# Altium project USB to SATA bridge.PrjPcb (part 2 of 2)

## Sheet Power.SchDoc
size A3; SheetNumber: 3; SheetTotal: 3
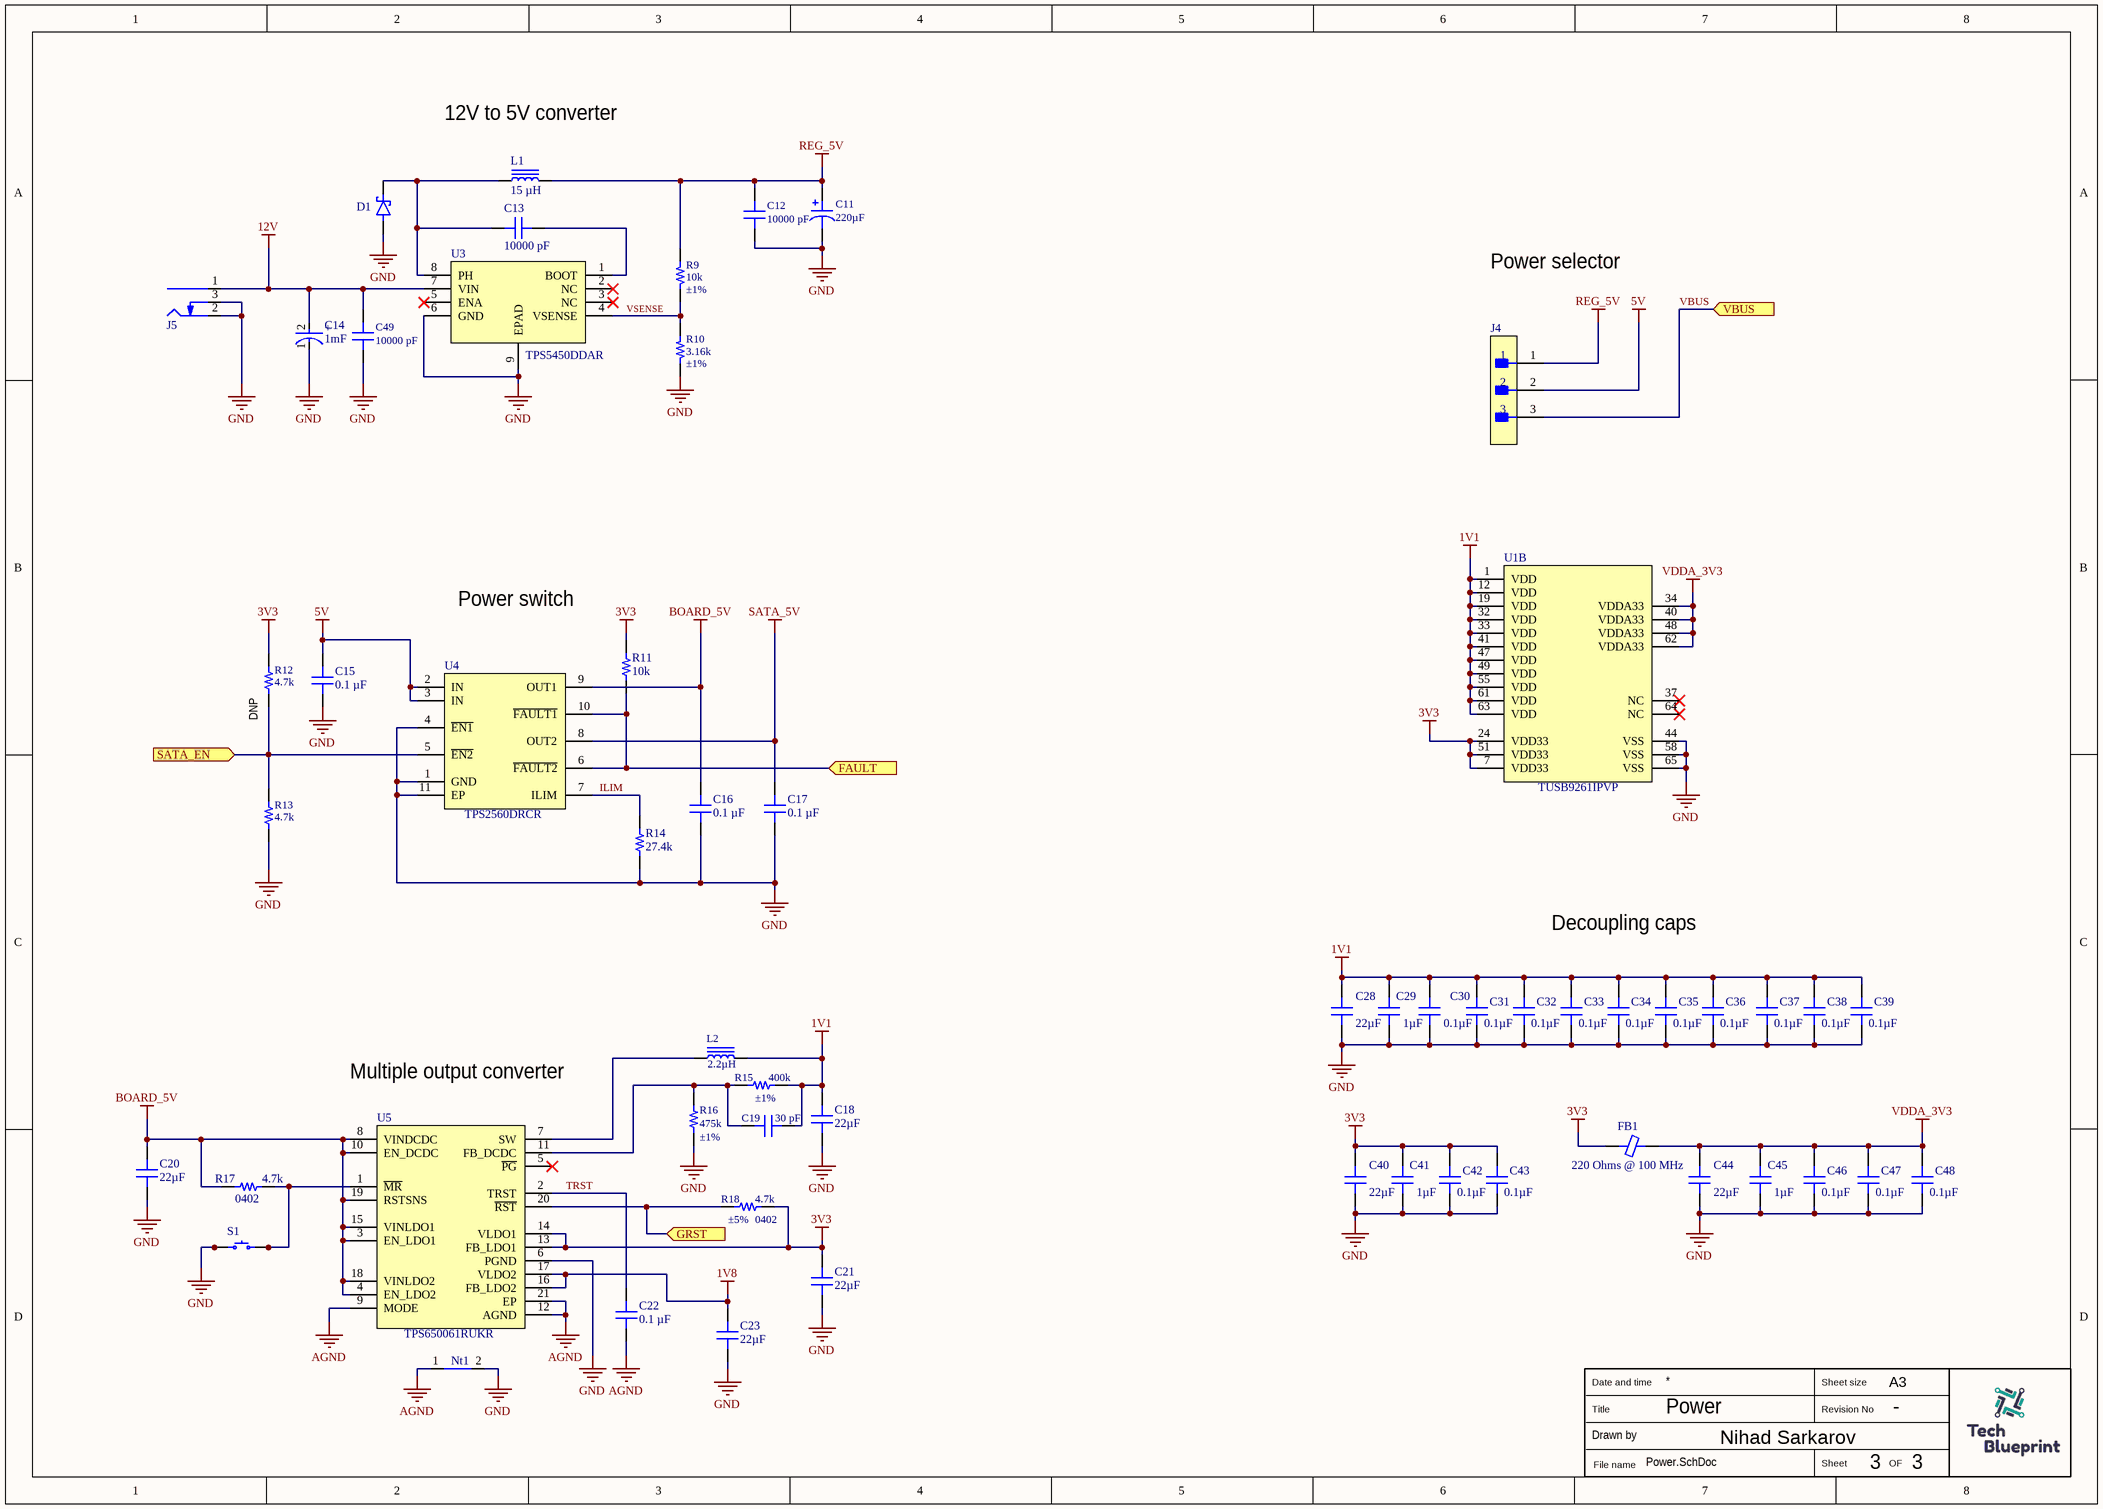
[diagram p2: Power.SchDoc]

### Parts
C11  220µF  [CAP ALSMD 8.3MM H10.5MM]
C12  10000 pF  [CAP 0805_2012]
C13  10000 pF  [CAP 0805_2012]
C14  Capacitance: 1mF  [FP-FTG-MFG]  (hidden comment: EEEFT1C102AP)
C15  0.1 µF  [CAP 0603_1608]
C16  0.1 µF  [CAP 0603_1608]
C17  0.1 µF  [CAP 0603_1608]
C18  22µF  [CAP 1206_3216 - 1.8MM]
C19  30 pF  [CAP 0402_1005]
C20  22µF  [CAP 1206_3216 - 1.8MM]
C21  22µF  [CAP 1206_3216 - 1.8MM]
C22  0.1 µF  [CAP 0603_1608]
C23  22µF  [CAP 1206_3216 - 1.8MM]
C28  22µF  [CAP 1206_3216 - 1.8MM]
C29  1µF  [CAP 0805_2012]
C30  0.1µF  [CAP 0805_2012]
C31  0.1µF  [CAP 0603_1608]
C32  0.1µF  [CAP 0603_1608]
C33  0.1µF  [CAP 0603_1608]
C34  0.1µF  [CAP 0603_1608]
C35  0.1µF  [CAP 0603_1608]
C36  0.1µF  [CAP 0603_1608]
C37  0.1µF  [CAP 0603_1608]
C38  0.1µF  [CAP 0603_1608]
C39  0.1µF  [CAP 0603_1608]
C40  22µF  [CAP 1206_3216 - 1.8MM]
C41  1µF  [CAP 0805_2012]
C42  0.1µF  [CAP 0603_1608]
C43  0.1µF  [CAP 0603_1608]
C44  22µF  [CAP 1206_3216 - 1.8MM]
C45  1µF  [CAP 0805_2012]
C46  0.1µF  [CAP 0603_1608]
C47  0.1µF  [CAP 0603_1608]
C48  0.1µF  [CAP 0603_1608]
C49  10000 pF  [CAP 0805_2012]
D1  MBRS540T3G  [DIOM7959X261N]  (value not drawn)
FB1  220 Ohms @ 100 MHz  [FER 0603_1608]
J4  87224-3  [FP-87224-3-MFG]  (value not drawn)
J5  PJ-002AH-SMT-TR  [CUI PJ-002AH-SMT-TR]  (value not drawn)
L1  15 µH  [BOURNS SRR1280]
L2  2.2µH  [IND 1008_2520]
Nt1  Net tie  [Net tie]  (value not drawn)  (net tie, no BOM)
R9  Tolerance: ±1%  [YAGEO RES 0603_1608]  (hidden comment: 10k)
R10  Tolerance: ±1%  [RES 0603_1608]  (hidden comment: 3.16k)
R11  10k  [YAGEO RES 0402_1005]
R12  4.7k  [RES 0603_1608]
R13  4.7k  [RES 0603_1608]
R14  27.4k  [RES 0402_1005]
R15  Tolerance: ±1%  [KOA RES RK73 RN73 0402_1005]  (hidden comment: 400k)
R16  Tolerance: ±1%  [RES 0402_1005]  (hidden comment: 475k)
R17  Supplier Device Package: 0402  [YAGEO RES 0402_1005]  (hidden comment: 4.7k)
R18  Supplier Device Package: 0402  Tolerance: ±5%  [YAGEO RES 0402_1005]  (hidden comment: 4.7k)
S1  PTS645SM43SMTR92 LFS  [C&K PTS645]  (value not drawn)
U1  TUSB9261IPVP  [FP-PVP0064A-IPC_A]  (part B of 2)
U3  TPS5450DDAR  [FP-DDA0008J-IPC_A]
U4  TPS2560DRCR  [FP-DRC0010J-IPC_A]
U5  TPS650061RUKR  [RUK0020B]

### Ports
FAULT (in), GRST (in, see USB to SATA bridge[4C]), SATA_EN (in), VBUS (in, see USB to SATA bridge[7B])

### Nets
1V1: C18.2 C19.2 C28.2 C29.2 C30.2 C31.2 C32.2 C33.2 C34.2 C35.2 C36.2 C37.2 C38.2 C39.2 L2.2 R15.2 U1.1(VDD) U1.12(VDD) U1.19(VDD) U1.32(VDD) U1.33(VDD) U1.41(VDD) U1.47(VDD) U1.49(VDD) U1.55(VDD) U1.61(VDD) U1.63(VDD)
1V8: C23.2 U5.16(FB_LDO2) U5.17(VLDO2)
3V3: C21.2 C40.2 C41.2 C42.2 C43.2 FB1.1 R11.2 R12.2 R18.2 U1.7(VDD33) U1.24(VDD33) U1.51(VDD33) U5.13(FB_LDO1) U5.14(VLDO1)
5V: C15.2 J4.2 U4.2(IN) U4.3(IN)
12V: C14.2(A) C49.2 J5.1(Centre) U3.7(VIN)
AGND: C22.1 Nt1.1 U5.9(MODE) U5.12(AGND) U5.21(EP)
BOARD_5V: C16.2 C20.2 R17.1 U4.9(OUT1) U5.3(EN_LDO1) U5.4(EN_LDO2) U5.8(VINDCDC) U5.10(EN_DCDC) U5.15(VINLDO1) U5.18(VINLDO2) U5.19(RSTSNS)
GND: C11.2 C12.1 C14.1(C) C15.1 C16.1 C17.1 C18.1 C20.1 C21.1 C23.1 C28.1 C29.1 C30.1 C31.1 C32.1 C33.1 C34.1 C35.1 C36.1 C37.1 C38.1 C39.1 C40.1 C41.1 C42.1 C43.1 C44.1 C45.1 C46.1 C47.1 C48.1 C49.1 D1.2(A) J5.2(Outer) J5.3(SW) Nt1.2 R10.1 R13.1 R14.1 R16.1 S1.1 S1.2 U1.44(VSS) U1.58(VSS) U1.65(VSS) U3.6(GND) U3.9(EPAD) U4.1(GND) U4.4(~{EN1}) U4.11(EP) U5.6(PGND)
REG_5V: C11.1 C12.2 J4.1 L1.1 R9.2
SATA_5V: C17.2 U4.8(OUT2)
VDDA_3V3: C44.2 C45.2 C46.2 C47.2 C48.2 FB1.2 U1.34(VDDA33) U1.40(VDDA33) U1.48(VDDA33) U1.62(VDDA33)
ILIM: R14.2 U4.7(ILIM)
TRST: C22.2 U5.2(TRST)
VBUS: J4.3 ; port VBUS
VSENSE: R9.1 R10.2 U3.4(VSENSE)
NetC13_1: C13.1 D1.1(C) L1.2 U3.8(PH)
NetC13_2: C13.2 U3.1(BOOT)
NetC19_1: C19.1 R15.1 R16.2 U5.11(FB_DCDC)
NetL2_1: L2.1 U5.7(SW)
NetR11_1: R11.1 U4.6(~{FAULT2}) U4.10(~{FAULT1}) ; port FAULT
NetR12_1: R12.1 R13.2 U4.5(~{EN2}) ; port SATA_EN
NetR17_2: R17.2 S1.3 S1.4 U5.1(~{MR})
NetR18_1: R18.1 U5.20(~{RST}) ; port GRST

Not connected (* = marked no-connect by the designer): U1 37(NC)* 64(NC)*; U3 2(NC)* 3(NC)* 5(ENA)*; U5 5(~{PG})*

### Notes on the sheet
- 12V to 5V converter
- Power selector
- Power switch
- (near R12) DNP
- Decoupling caps
- Multiple output converter
- Power
- -
- 3
- Date and time
- Sheet size
- A3
- Title
- Drawn by
- File name
- Nihad Sarkarov
- Sheet
- Revision No
- OF
- (in symbol CMP-05427-000086-1) +

### Library data of the parts
C11 = UUR1E221MNL6GS: CAP ALUM 220UF 20% 25V SMD; manufacturer: Nichicon; Lifetime @ Temp.: 2000 Hrs @ 85°C; Ripple Current @ High Frequency: 301.6mA @ 10kHz; Ripple Current @ Low Frequency: 232mA @ 120Hz; Surface Mount Land Size: 0.327" L x 0.327" W (8.30mm x 8.30mm); Part Number: UUR1E221MNL6GS; Applications: General Purpose; Capacitance: 220µF; componentlink1description: Datasheet; componentlink1url: http://nichicon-us.com/english/products/pdfs/e-uur.pdf; componentlink2description: DigiKey Link; componentlink2url: http://digikey.com/product-detail/en/nichicon/UUR1E221MNL6GS/493-6222-1-ND/3438735; Device Package: Radial, Can - SMD; Height - Seated (Max): 0.413" (10.50mm); lastupdated: 9/2/2020 1:25:16 AM; Lifecycle Status: Active; Minimum Order: 1; Mounting Type: Surface Mount; Operating Temperature: -40°C ~ 85°C; Package / Case: Radial, Can - SMD; packaging: TapeAndReel; partid: 7456; Part Status: Active; price: 0.19; series: UUR; Size / Dimension: 0.315" Dia (8.00mm); Supplier 1: DigiKey; Supplier Part Number 1: 493-6222-1-ND; Tolerance: ±20%; value: 220µF; Voltage - Rated: 25V
C12 C13 C49 = C0805X103K1RAC3316: CAP CER 0805 10NF 100V X7R; manufacturer: KEMET; Tolerance: ±10%; Part Number: C0805X103K1RAC3316; Capacitance: 10000 pF; Applications: Automotive, Boardflex Sensitive; componentlink1description: Datasheet; componentlink1url: https://api.kemet.com/component-edge/download/datasheet/C0805X103K1RAC3316.pdf; componentlink2description: DigiKey Link; componentlink2url: https://www.digikey.com/en/products/detail/kemet/C0805X103K1RAC3316/10315780; Device Package: 0805 (2012 Metric); Features: Soft Termination; lastupdated: 2/9/2024 8:16:09 PM; Lifecycle Status: Active; Minimum Order: 1; Mounting Type: Surface Mount, MLCC; Operating Temperature: -55°C ~ 125°C; Package / Case: 0805 (2012 Metric); packaging: TapeAndReel; partid: 2565; Part Status: Active; price: 0.02; Ratings: AEC-Q200; series: SMD Auto X7R VW80808; Size / Dimension: 0.079" L x 0.049" W (2.00mm x 1.25mm); Supplier 1: DigiKey; Supplier Part Number 1: 399-C0805X103K1RAC3316CT-ND; Temperature Coefficient: X7R; Thickness (Max): 0.039" (0.98mm); value: 10000 pF; Voltage - Rated: 100V
C14 = CMP-05427-000086-1: CAP ALUM 1000UF 20% 16V SMD; Life (Hours): 2000Hour; Ripple Current: 1.19A; ESR (Equivalent Series Resistance): 60mR; Leakage Current: 160uA; Lead Diameter: 0.9mm; Height: 10.2mm; Radiation Hardening: No; Tolerance: 20%; Lead Free: Lead Free; Construction: Cylindrical; Voltage Rating (DC): 16V; Package Quantity: 1; REACH SVHC: No SVHC; Series: FT; Packaging: Tape and Reel; RoHS Compliant: Yes; Lead Pitch: 4.6mm; Diameter: 10mm; Voltage Rating: 16V; Height - Seated (Max): 0.413inch; Length: 10.2mm; Voltage: 16V; Max Operating Temperature: 105°C; Ripple Current (AC): 1.19A; Min Operating Temperature: -55°C; Termination: SMD/SMT; Mount: Surface Mount; Case/Package: Radial
C15-C17 C22 = CL10B104KB85PND: CAP CER 0.1UF 50V X7R 0603; manufacturer: Samsung Electro-Mechanics; Tolerance: ±10%; Part Number: CL10B104KB85PND; Capacitance: 0.1 µF; Applications: Automotive; componentlink1description: Datasheet; componentlink1url: http://www.samsungsem.com/kr/support/product-search/mlcc/CL10B104KB85PND.jsp; componentlink2description: DigiKey Link; componentlink2url: https://www.digikey.com/en/products/detail/samsung-electro-mechanics/CL10B104KB85PND/7320490; Device Package: 0603 (1608 Metric); Features: Open Mode; lastupdated: 2/9/2024 8:10:28 PM; Lifecycle Status: Active; Minimum Order: 1; Mounting Type: Surface Mount, MLCC; Operating Temperature: -55°C ~ 125°C; Package / Case: 0603 (1608 Metric); packaging: TapeAndReel; partid: 4208; Part Status: Active; price: 0.01; Ratings: AEC-Q200; series: CL; Size / Dimension: 0.063" L x 0.031" W (1.60mm x 0.80mm); Supplier 1: DigiKey; Supplier Part Number 1: 1276-6985-1-ND; Temperature Coefficient: X7R; Thickness (Max): 0.035" (0.90mm); value: 0.1 µF; Voltage - Rated: 50V
C18 C20 C21 C23 C28 C40 C44 = 1206YD226KAT2A: CAP CER 22UF 16V X5R 1206; manufacturer: AVX Corporation; Tolerance: ±10%; Part Number: 1206YD226KAT2A; Capacitance: 22µF; Applications: General Purpose; componentlink1description: Datasheet; componentlink1url: http://datasheets.avx.com/cx5r.pdf; componentlink2description: DigiKey Link; componentlink2url: http://digikey.com/product-detail/en/avx-corporation/1206YD226KAT2A/478-5727-1-ND/2136335; Device Package: 1206 (3216 Metric); lastupdated: 9/2/2020 1:05:39 AM; Lifecycle Status: Active; Minimum Order: 1; Mounting Type: Surface Mount, MLCC; Operating Temperature: -55°C ~ 85°C; Package / Case: 1206 (3216 Metric); packaging: TapeAndReel; partid: 20319; Part Status: Active; price: 0.48; series: -; Size / Dimension: 0.126" L x 0.063" W (3.20mm x 1.60mm); Supplier 1: DigiKey; Supplier Part Number 1: 478-5727-1-ND; Temperature Coefficient: X5R; Thickness (Max): 0.070" (1.78mm); value: 22µF; Voltage - Rated: 16V
C19 = C0402C300K5GAC7867: CAP CER 30PF 50V NP0 0402; manufacturer: KEMET; Temperature Coefficient: C0G, NP0; Tolerance: ±10%; Part Number: C0402C300K5GAC7867; Capacitance: 30 pF; Applications: General Purpose; componentlink1description: Datasheet; componentlink1url: https://api.kemet.com/component-edge/download/datasheet/C0402C300K5GACTU.pdf; componentlink2description: DigiKey Link; componentlink2url: https://www.digikey.com/en/products/detail/kemet/C0402C300K5GAC7867/2196571; Device Package: 0402 (1005 Metric); Features: Low ESL; lastupdated: 2/9/2024 8:04:30 PM; Lifecycle Status: Active; Minimum Order: 1; Mounting Type: Surface Mount, MLCC; Operating Temperature: -55°C ~ 125°C; Package / Case: 0402 (1005 Metric); packaging: TapeAndReel; partid: 6610; Part Status: Active; price: 0.06; series: SMD Comm C0G; Size / Dimension: 0.039" L x 0.020" W (1.00mm x 0.50mm); Supplier 1: DigiKey; Supplier Part Number 1: 399-14440-1-ND; Thickness (Max): 0.022" (0.55mm); value: 30 pF; Voltage - Rated: 50V
C29 C41 C45 = MM05ZC105KCZ2A: CAP CER 1UF 10V X7R 0805; manufacturer: AVX Corporation; Tolerance: ±10%; Part Number: MM05ZC105KCZ2A; Capacitance: 1µF; Applications: Medical, Non-Critical; componentlink1description: Datasheet; componentlink1url: http://datasheets.avx.com/AVX-MM.pdf; componentlink2description: DigiKey Link; componentlink2url: http://digikey.com/product-detail/en/avx-corporation/MM05ZC105KCZ2A/478-10611-1-ND/7344872; Device Package: 0805 (2012 Metric); lastupdated: 9/2/2020 1:04:42 AM; Lifecycle Status: Active; Minimum Order: 1; Mounting Type: Surface Mount, MLCC; Operating Temperature: -55°C ~ 125°C; Package / Case: 0805 (2012 Metric); packaging: TapeAndReel; partid: 2439; Part Status: Active; price: 0.50; series: MM; Size / Dimension: 0.079" L x 0.049" W (2.01mm x 1.25mm); Supplier 1: DigiKey; Supplier Part Number 1: 478-10611-1-ND; Temperature Coefficient: X7R; Thickness (Max): 0.029" (0.74mm); value: 1µF; Voltage - Rated: 10V
C30 = 08053C104KAT4A: CAP CER 0.1UF 25V X7R 0805; manufacturer: AVX Corporation; Tolerance: ±10%; Part Number: 08053C104KAT4A; Capacitance: 0.1µF; Applications: General Purpose; componentlink1description: Datasheet; componentlink1url: http://datasheets.avx.com/X7RDielectric.pdf; componentlink2description: DigiKey Link; componentlink2url: http://digikey.com/product-detail/en/avx-corporation/08053C104KAT4A/478-13052-1-ND/9948570; Device Package: 0805 (2012 Metric); lastupdated: 9/2/2020 1:04:37 AM; Lifecycle Status: Active; Minimum Order: 1; Mounting Type: Surface Mount, MLCC; Operating Temperature: -55°C ~ 125°C; Package / Case: 0805 (2012 Metric); packaging: TapeAndReel; partid: 5333; Part Status: Active; price: 0.02; series: -; Size / Dimension: 0.079" L x 0.049" W (2.01mm x 1.25mm); Supplier 1: DigiKey; Supplier Part Number 1: 478-13052-1-ND; Temperature Coefficient: X7R; Thickness (Max): 0.037" (0.94mm); value: 0.1µF; Voltage - Rated: 25V
C31-C39 C42 C43 C46-C48 = 06033C104K4T4A: CAP CER 0.1UF 25V X7R 0603; manufacturer: AVX Corporation; Tolerance: ±10%; Part Number: 06033C104K4T4A; Capacitance: 0.1µF; Applications: Automotive; componentlink1description: Datasheet; componentlink1url: http://datasheets.avx.com/AutoMLCC.pdf; componentlink2description: DigiKey Link; componentlink2url: http://digikey.com/product-detail/en/avx-corporation/06033C104K4T4A/478-10673-1-ND/7536544; Device Package: 0603 (1608 Metric); lastupdated: 9/2/2020 1:03:35 AM; Lifecycle Status: Active; Minimum Order: 1; Mounting Type: Surface Mount, MLCC; Operating Temperature: -55°C ~ 125°C; Package / Case: 0603 (1608 Metric); packaging: TapeAndReel; partid: 2749; Part Status: Active; price: 0.02; Ratings: AEC-Q200; series: -; Size / Dimension: 0.063" L x 0.032" W (1.60mm x 0.81mm); Supplier 1: DigiKey; Supplier Part Number 1: 478-10673-1-ND; Temperature Coefficient: X7R; Thickness (Max): 0.035" (0.90mm); value: 0.1µF; Voltage - Rated: 25V
D1 = MBRS540T3G: MF: {'manufacturer': u'ON Semiconductor'}; Package: None; Price: None; Value: *; MP: MBRS540T3G; Availability: Unavailable
FB1 = Z0603C221BPWZT: POWER LINE HIGH IMPEDANCE FERRIT; Manufacturer: KEMET; Current Rating (Max): 1.5A; DC Resistance (DCR) (Max): 70mOhm; Number of Lines: 1; Part Number: Z0603C221BPWZT; ComponentLink1Description: Datasheet; ComponentLink1URL: https://api.kemet.com/component-edge/download/datasheet/Z0603C221BPWZT.pdf; ComponentLink2Description: DigiKey Link; ComponentLink2URL: https://www.digikey.com/en/products/detail/kemet/Z0603C221BPWZT/12708723; Device Package: 0603 (1608 Metric); Filter Type: Power Line; Height (Max): 0.035" (0.90mm); Impedance @ Frequency: 220 Ohms @ 100 MHz; LastUpdated: 6/3/2024 7:51:44 PM; Lifecycle Status: Active; Minimum Order: 1; Mounting Type: Surface Mount; Operating Temperature: -40°C ~ 125°C; Package / Case: 0603 (1608 Metric); Packaging: TapeAndReel; PartId: 2194; Part Status: Active; Price: 0.05; Series: Z-PWZ; Size / Dimension: 0.063" L x 0.031" W (1.60mm x 0.80mm); Supplier 1: DigiKey; Supplier Part Number 1: 399-Z0603C221BPWZTCT-ND; Value: 220 Ohms @ 100 MHz
J4 = CMP-2000-05697-2: CONN HEADER VERT 3POS 2.54MM; Number of Positions: 3; Gasket: No (Without); High Speed Serial Data Connector: No; Current Rating: 3A; Contact Post Length: 0.125inch; PCB Thickness: 1.397mm; PCB Mount Retention: Without; Connector Type: Plug; Approvals: CSA; PCB Mounting Orientation: Vertical; Pitch: 2.54mm; Mating Alignment: No (Without); Housing Color: Black; Contact Gender: Male; Length: 7.21mm; Max Operating Temperature: 105°C; Strain Relief: No (Without); Contact Material: Bronze; Row Spacing: 2.54mm; Series: AMPMODU MOD II; Board Standoff: No (Without); Package Quantity: 520; Radiation Hardening: No; Contact Protection: No (Without); Stabilizers: No (Without); Number of Rows: 1; Contact Mating Length: 8.08mm; Contact Shape: Square; Depth: 2.54mm; Contact Current Rating: 3A; Flammability Rating: UL94 V-0; Packaging: Carton; Number of Contacts: 3; Orientation: Straight; Mount: Through Hole; Keyed: No; Contact Type: Male Pin; Housing Material: Thermoplastic; High Temperature Housing: No; ELV: Compliant; Contact Plating: Gold; Termination: Through Hole; Selectively Loaded: No (Without); Lead Free: Lead Free; Min Operating Temperature: -65°C; Mating Connector Lock: No (Without); Color: Black; RoHS Compliant: Yes
J5 = PJ-002AH-SMT-TR: CONN PWR JACK 2X5.5MM SOLDER; Manufacturer: CUI Devices; Actual Diameter: 0.079" (2.00mm ID), 0.256" (6.50mm OD); Current Rating (Amps): 5A; Gender: Male; Industry Recognized Mating Diameter: 2.00mm ID (0.079"), 5.50mm OD (0.217"); Internal Switch(s): Single Switch, Normally Closed; Material Flammability Rating: UL94 V-0; Mating Length/Depth: 0.350" (8.90mm); Number of Positions/Contacts: 2 Conductors, 3 Contacts; Shielding: Unshielded; Voltage - Rated: 24VDC; Part Number: PJ-002AH-SMT-TR; ComponentLink1Description: Datasheet; ComponentLink1URL: https://www.cuidevices.com/product/resource/digikeypdf/pj-002ah-smt-tr.pdf; ComponentLink2Description: DigiKey Link; ComponentLink2URL: http://digikey.com/product-detail/en/cui-devices/PJ-002AH-SMT-TR/CP-002AHPJCT-ND/669692; Connector Type: Jack; Features: Board Guide; LastUpdated: 5/26/2020 1:33:39 PM; Lifecycle Status: Active; Minimum Order: 1; Mounting Type: Surface Mount; Packaging: TapeAndReel; Part Status: Active; Price: 0.90; Series: -; Supplier 1: DigiKey; Supplier Part Number 1: CP-002AHPJCT-ND; Termination: Solder
L1 = SRR1280-150M: FIXED IND 15UH 5.2A 28.5MOHM SMD; Manufacturer: Bourns Inc.; Current - Saturation: 5A; DC Resistance (DCR): 28.5mOhm Max; Frequency - Self Resonant: 13MHz; Inductance Frequency - Test: 100 kHz; Material - Core: Ferrite; Q @ Freq: 26 @ 2.52MHz; Shielding: Shielded; Tolerance: ±20%; Type: Drum Core, Wirewound; Part Number: SRR1280-150M; ComponentLink1Description: Datasheet; ComponentLink1URL: https://www.bourns.com/docs/Product-Datasheets/SRR1280.pdf; ComponentLink2Description: DigiKey Link; ComponentLink2URL: https://www.digikey.com/en/products/detail/bourns-inc/SRR1280-150M/1969994; Current Rating (Amps): 5.2 A; Device Package: Nonstandard; Height - Seated (Max): 0.315" (8.00mm); Inductance: 15 µH; LastUpdated: 6/3/2024 8:02:37 PM; Lifecycle Status: Active; Minimum Order: 1; Mounting Type: Surface Mount; Operating Temperature: -40°C ~ 125°C; Package / Case: Nonstandard; Packaging: TapeAndReel; PartId: 20; Part Status: Active; Price: 0.51; Series: SRR1280; Size / Dimension: 0.492" L x 0.492" W (12.50mm x 12.50mm); Supplier 1: DigiKey; Supplier Part Number 1: SRR1280-150MCT-ND; Value: 15 µH
L2 = CKP2520V2R2M-T: FIXED IND 2.2UH 700MA 150 MOHM; Manufacturer: Taiyo Yuden; DC Resistance (DCR): 150mOhm Max; Inductance Frequency - Test: 1MHz; Material - Core: Ferrite; Shielding: Unshielded; Tolerance: ±20%; Type: Multilayer; Part Number: CKP2520V2R2M-T; ComponentLink1Description: Datasheet; ComponentLink1URL: https://ds.yuden.co.jp/TYCOMPAS/ut/detail?pn=CKP2520V2R2M-T  &u=M; ComponentLink2Description: DigiKey Link; ComponentLink2URL: http://digikey.com/product-detail/en/taiyo-yuden/CKP2520V2R2M-T/587-2182-1-ND/2002880; Current Rating (Amps): 700mA; Current - Saturation: 700mA; Device Package: 1008 (2520 Metric); Height - Seated (Max): 0.039" (1.00mm); Inductance: 2.2µH; LastUpdated: 6/3/2024 8:23:57 PM; Lifecycle Status: Active; Minimum Order: 1; Mounting Type: Surface Mount; Operating Temperature: -40°C ~ 85°C; Package / Case: 1008 (2520 Metric); Packaging: TapeAndReel; PartId: 3526; Part Status: Active; Price: 0.13; Series: CK, P Type; Size / Dimension: 0.098" L x 0.079" W (2.50mm x 2.00mm); Supplier 1: DigiKey; Supplier Part Number 1: 587-2182-1-ND; Supplier Device Package: 1008 (2520 Metric); Value: 2.2µH
Nt1 = Net tie: Net tie SMD
R9 = RT0603FRE0710KL: RES SMD 10K OHM 1% 1/10W 0603; Manufacturer: Yageo; Power (Watts): 0.1W, 1/10W; Resistance: 10 kOhms; Temperature Coefficient: ±50ppm/°C; Part Number: RT0603FRE0710KL; Value: 10k; ComponentLink1Description: Datasheet; ComponentLink1URL: https://www.yageo.com/upload/media/product/productsearch/datasheet/rchip/PYu-RT_1-to-0.01_RoHS_L_11.pdf; ComponentLink2Description: DigiKey Link; ComponentLink2URL: https://www.digikey.com/en/products/detail/yageo/RT0603FRE0710KL/1075040; Composition: Thin Film; Device Package: 0603 (1608 Metric); Height - Seated (Max): 0.022" (0.55mm); LastUpdated: 7/25/2024 9:19:32 AM; Lifecycle Status: Active; Minimum Order: 1; Number of Terminations: 2; Operating Temperature: -55°C ~ 155°C; Package / Case: 0603 (1608 Metric); Packaging: TapeAndReel; PartId: 5671; Part Status: Active; Price: 0.01; Series: RT; Size / Dimension: 0.063" L x 0.031" W (1.60mm x 0.80mm); Supplier 1: DigiKey; Supplier Part Number 1: YAG2321CT-ND; Supplier Device Package: 0603
R10 = CR0603-FX-3161ELF: RES SMD 3.16K OHM 1% 1/10W 0603; Manufacturer: Bourns Inc.; Power (Watts): 0.1W, 1/10W; Resistance: 3.16 kOhms; Temperature Coefficient: ±100ppm/°C; Part Number: CR0603-FX-3161ELF; Value: 3.16k; ComponentLink1Description: Datasheet; ComponentLink1URL: https://www.bourns.com/docs/Product-Datasheets/CHPREZTR.pdf; ComponentLink2Description: DigiKey Link; ComponentLink2URL: https://www.digikey.com/en/products/detail/bourns-inc/CR0603-FX-3161ELF/3783939; Composition: Thick Film; Device Package: 0603 (1608 Metric); Features: Moisture Resistant; Height - Seated (Max): 0.022" (0.55mm); LastUpdated: 2/9/2024 8:43:23 PM; Lifecycle Status: Active; Minimum Order: 1; Number of Terminations: 2; Operating Temperature: -55°C ~ 155°C; Package / Case: 0603 (1608 Metric); Packaging: CutTape; PartId: 8282; Part Status: Active; Price: 0.01; Series: CR0603; Size / Dimension: 0.063" L x 0.031" W (1.60mm x 0.80mm); Supplier 1: DigiKey; Supplier Part Number 1: CR0603-FX-3161ELFCT-ND; Supplier Device Package: 0603
R11 = AC0402JR-0710KL: RES SMD 10K OHM 5% 1/16W 0402; Manufacturer: Yageo; Power (Watts): 0.063W, 1/16W; Resistance: 10 kOhms; Temperature Coefficient: ±100ppm/°C; Part Number: AC0402JR-0710KL; Value: 10k; ComponentLink1Description: Datasheet; ComponentLink1URL: https://www.yageo.com/upload/media/product/productsearch/datasheet/rchip/PYu-AC_51_RoHS_L_7.pdf; ComponentLink2Description: DigiKey Link; ComponentLink2URL: https://www.digikey.com/en/products/detail/yageo/AC0402JR-0710KL/5895571; Composition: Thick Film; Device Package: 0402 (1005 Metric); Features: Automotive AEC-Q200, Moisture Resistant; Height - Seated (Max): 0.015" (0.37mm); LastUpdated: 7/25/2024 9:18:18 AM; Lifecycle Status: Active; Minimum Order: 1; Number of Terminations: 2; Operating Temperature: -55°C ~ 155°C; Package / Case: 0402 (1005 Metric); Packaging: CutTape; PartId: 3376; Part Status: Active; Price: 0.01; Ratings: AEC-Q200; Series: AC; Size / Dimension: 0.039" L x 0.020" W (1.00mm x 0.50mm); Supplier 1: DigiKey; Supplier Part Number 1: YAG3517CT-ND; Supplier Device Package: 0402; Tolerance: ±5%
R12 R13 = RMCF0603JT4K70: RES 4.7K OHM 5% 1/10W 0603; Manufacturer: Stackpole Electronics Inc; Power (Watts): 0.1W, 1/10W; Resistance: 4.7 kOhms; Temperature Coefficient: ±200ppm/°C; Part Number: RMCF0603JT4K70; Value: 4.7k; ComponentLink1Description: Datasheet; ComponentLink1URL: https://www.seielect.com/catalog/sei-packaging.pdf; ComponentLink2Description: DigiKey Link; ComponentLink2URL: https://www.digikey.com/en/products/detail/stackpole-electronics-inc/RMCF0603JT4K70/1757976; Composition: Thick Film; Device Package: 0603 (1608 Metric); Features: Automotive AEC-Q200; Height - Seated (Max): 0.022" (0.55mm); LastUpdated: 2/9/2024 8:43:33 PM; Lifecycle Status: Active; Minimum Order: 1; Number of Terminations: 2; Operating Temperature: -55°C ~ 155°C; Package / Case: 0603 (1608 Metric); Packaging: CutTape; PartId: 5821; Part Status: Active; Price: 0.01; Ratings: AEC-Q200; Series: RMCF; Size / Dimension: 0.061" L x 0.031" W (1.55mm x 0.80mm); Supplier 1: DigiKey; Supplier Part Number 1: RMCF0603JT4K70CT-ND; Supplier Device Package: 0603; Tolerance: ±5%
R14 = ERJ-2RKF2742X: RES SMD 27.4K OHM 1% 1/10W 0402; Manufacturer: Panasonic Electronic Components; Power (Watts): 0.1W, 1/10W; Resistance: 27.4 kOhms; Temperature Coefficient: ±100ppm/°C; Part Number: ERJ-2RKF2742X; Value: 27.4k; ComponentLink1Description: Datasheet; ComponentLink1URL: https://industrial.panasonic.com/cdbs/www-data/pdf/RDA0000/AOA0000C304.pdf; ComponentLink2Description: DigiKey Link; ComponentLink2URL: https://www.digikey.com/en/products/detail/panasonic-electronic-components/ERJ-2RKF2742X/192263; Composition: Thick Film; Device Package: 0402 (1005 Metric); Features: Automotive AEC-Q200; Height - Seated (Max): 0.016" (0.40mm); LastUpdated: 2/9/2024 8:30:19 PM; Lifecycle Status: Active; Minimum Order: 1; Number of Terminations: 2; Operating Temperature: -55°C ~ 155°C; Package / Case: 0402 (1005 Metric); Packaging: CutTape; PartId: 3731; Part Status: Active; Price: 0.01; Ratings: AEC-Q200; Series: ERJ-2RK; Size / Dimension: 0.039" L x 0.020" W (1.00mm x 0.50mm); Supplier 1: DigiKey; Supplier Part Number 1: P27.4KLCT-ND; Supplier Device Package: 0402; Tolerance: ±1%
R15 = RK73H1ETTP4123F: RES 400K OHM 1% 1/10W 0402; Manufacturer: KOA Speer Electronics, Inc.; Power (Watts): 0.1W, 1/10W; Resistance: 412 kOhms; Temperature Coefficient: ±100ppm/°C; Part Number: RK73H1ETTP4123F; Value: 400k; ComponentLink1Description: Datasheet; ComponentLink1URL: http://www.koaspeer.com/catimages/Products/RK73H/RK73H.pdf; ComponentLink2Description: DigiKey Link; ComponentLink2URL: https://www.digikey.com/en/products/detail/koa-speer-electronics-inc/RK73H1ETTP4123F/9844472; Composition: Thick Film; Device Package: 0402 (1005 Metric); Features: Automotive AEC-Q200; Height - Seated (Max): 0.016" (0.40mm); LastUpdated: 7/25/2024 9:41:31 AM; Lifecycle Status: Active; Minimum Order: 1; Number of Terminations: 2; Operating Temperature: -55°C ~ 155°C; Package / Case: 0402 (1005 Metric); Packaging: CutTape; PartId: 13413; Part Status: Active; Price: 0.01; Ratings: AEC-Q200; Series: RK73H; Size / Dimension: 0.039" L x 0.020" W (1.00mm x 0.50mm); Supplier 1: DigiKey; Supplier Part Number 1: 2019-RK73H1ETTP4123FCT-ND; Supplier Device Package: 0402
R16 = RMCF0402FT475K: RES 475K OHM 1% 1/16W 0402; Manufacturer: Stackpole Electronics Inc; Power (Watts): 0.063W, 1/16W; Resistance: 475 kOhms; Temperature Coefficient: ±100ppm/°C; Part Number: RMCF0402FT475K; Value: 475k; ComponentLink1Description: Datasheet; ComponentLink1URL: https://www.seielect.com/catalog/sei-rmcf_rmcp.pdf; ComponentLink2Description: DigiKey Link; ComponentLink2URL: https://www.digikey.com/en/products/detail/stackpole-electronics-inc/RMCF0402FT475K/1761399; Composition: Thick Film; Device Package: 0402 (1005 Metric); Features: Automotive AEC-Q200; Height - Seated (Max): 0.016" (0.40mm); LastUpdated: 2/9/2024 8:30:00 PM; Lifecycle Status: Active; Minimum Order: 1; Number of Terminations: 2; Operating Temperature: -55°C ~ 155°C; Package / Case: 0402 (1005 Metric); Packaging: CutTape; PartId: 8553; Part Status: Active; Price: 0.01; Ratings: AEC-Q200; Series: RMCF; Size / Dimension: 0.039" L x 0.020" W (1.00mm x 0.50mm); Supplier 1: DigiKey; Supplier Part Number 1: RMCF0402FT475KCT-ND; Supplier Device Package: 0402
R17 R18 = AC0402JR-074K7L: RES SMD 4.7K OHM 5% 1/16W 0402; Manufacturer: Yageo; Power (Watts): 0.063W, 1/16W; Resistance: 4.7 kOhms; Temperature Coefficient: ±100ppm/°C; Part Number: AC0402JR-074K7L; Value: 4.7k; ComponentLink1Description: Datasheet; ComponentLink1URL: https://www.yageo.com/upload/media/product/productsearch/datasheet/rchip/PYu-AC_51_RoHS_L_7.pdf; ComponentLink2Description: DigiKey Link; ComponentLink2URL: https://www.digikey.com/en/products/detail/yageo/AC0402JR-074K7L/2827810; Composition: Thick Film; Device Package: 0402 (1005 Metric); Features: Automotive AEC-Q200, Moisture Resistant; Height - Seated (Max): 0.015" (0.37mm); LastUpdated: 7/25/2024 9:18:18 AM; Lifecycle Status: Active; Minimum Order: 1; Number of Terminations: 2; Operating Temperature: -55°C ~ 155°C; Package / Case: 0402 (1005 Metric); Packaging: CutTape; PartId: 3400; Part Status: Active; Price: 0.01; Ratings: AEC-Q200; Series: AC; Size / Dimension: 0.039" L x 0.020" W (1.00mm x 0.50mm); Supplier 1: DigiKey; Supplier Part Number 1: 311-4.7KLBCT-ND
  R17: Tolerance: ±5%
S1 = PTS645SM43SMTR92 LFS: SWITCH TACTILE SPST-NO 0.05A 12V; Manufacturer: C&K; Actuator Height off PCB, Vertical: 4.30mm; Actuator Orientation: Top Actuated; Actuator Type: Standard; Contact Rating @ Voltage: 0.05A @ 12VDC; Illumination: Non-Illuminated; Operating Force: 160gf; Outline: 6.00mm x 6.00mm; Switch Function: Off-Mom; Part Number: PTS645SM43SMTR92 LFS; Circuit: SPST-NO; ComponentLink1Description: Datasheet; ComponentLink1URL: https://dznh3ojzb2azq.cloudfront.net/products/Tactile/PTS645/documents/datasheet.pdf; ComponentLink2Description: DigiKey Link; ComponentLink2URL: http://digikey.com/product-detail/en/c-k/PTS645SM43SMTR92-LFS/CKN9112CT-ND/1146934; Features: Blue Actuator; LastUpdated: 4/9/2020 9:59:00 AM; Lifecycle Status: Active; Minimum Order: 1; Mounting Type: Surface Mount; Operating Temperature: -20°C ~ 60°C; Packaging: TapeAndReel; Part Status: Active; Price: 0.09; Series: PTS645; Supplier 1: DigiKey; Supplier Part Number 1: CKN9112CT-ND; Termination Style: Gull Wing
U1 = TUSB9261IPVP: HDD, CD, DVD Drive Interface 64-HTQFP (7x7); Manufacturer: Texas Instruments; Interface: USB; Supplier 1: Mouser; Supplier Part Number 1: 595-TUSB9261IPVP; DigiKey Part Number: 296-35545-ND; Manufacturer Product Number: TUSB9261IPVP; Applications: HDD, CD, DVD Drive; Package / Case: 64-TQFP Exposed Pad
U3 = CMP-04918-000100-1: IC REG BUCK ADJUSTABLE 5A 8SOPWR; Manufacturer: Texas Instruments; Output Type: AdjustableProgrammable; Output Voltage: 1.22-31V; Max Duty Cycle: 89%; Min Supply Voltage: 5.5V; Standoff Height: 0mm; Max Junction Temp: +125°C; Max Supply Voltage: 36V; Nominal Supply Current: 3mA; Number Of Outputs: 1; Switching Frequency: 500kHz; Device Class L3: Voltage Regulators - Switching; Octopart: https://octopart.com/tps5450ddar-texas+instruments-7105511; Temperature: -40°C to +125°C; Mouser Description: Conv DC-DC 5.5V to 36V Step Down Single-Out 1.22V to 31V 5A 8-Pin HSOP EP T/R; Device Class L1: Integrated Circuits (ICs); ComponentLink2URL: https://www.ti.com/lit/ds/symlink/tps5450.pdf; Automotive: No; Package: DDA0008J; ComponentLink2Description: Datasheet; Temperature Range Low: -40°C; RoHS: TRUE; Digikey Description: IC REG BUCK ADJUSTABLE 5A 8SOPWR; Lead Free: Yes; Manufacturer Part Number: TPS5450DDAR; Device Class L2: Power Management ICs; Temperature Range High: +125°C; Output Current: 5A; Height: 1.7mm; Ipc Land Pattern Name: SOIC127P600X170-8; Category: IC; Switching Topology: Buck; Supplier 1: Mouser; Supplier Part Number 1: 595-TPS5450DDAR
U4 = CMP-0337-00200-3: IC PWR SWITCH N-CHAN 1:2 10VSON; Fault Protection: Over Temperature; Nominal Supply Current: 100uA; Number of Switches: 2; Turn-Off Delay Time: 6ms; On-State Resistance: 70mR; Max Supply Voltage: 6.5V; Min Input Voltage: 2.5V; Max Power Dissipation: 2.403W; Turn-On Delay Time: 9ms; Max Output Current: 2.5A; Interface: On/Off; Output Configuration: High Side; Package Quantity: 3000; RoHS Compliant: Yes; Lead Free: Lead Free; Min Operating Temperature: -40°C; Radiation Hardening: No; Max Operating Temperature: 85°C; Max Input Voltage: 6.5V; Min Supply Voltage: 2.5V; Number of Outputs: 2; Number of Pins: 10; Supply Current: 100uA; Type: General Purpose; Series: -; Case/Package: VSON; Packaging: Tape and Reel
U5 = CMP-1518-00013-2: 1 A, 2.25 MHz Step-Down Converter with Dual LDOs & SVS, 2.3 to 6 V, -40 to 85 degC, 20-pin WQFN (RUK), Green (RoHS & no Sb/Br); Manufacturer: Texas Instruments; Vin(Min)(V): 2.3; Iout(Max)(A): 1; Regulated Outputs(#): 3; Eco-Plan: TRUE; Packing: Large Tape and Reel; Vin(Max)(V): 6; ComponentLink3Description: Package Specification; PackageDescription: 20-Pin Plastic Flat Pack, Body 3 x 3 mm, Pitch 0.4 mm; Code_JEDEC: MO-220; ComponentLink2Description: Datasheet; ComponentLink1URL: http://www.ti.com/; ComponentLink2URL: http://www.ti.com/lit/ds/symlink/tps650061.pdf; ComponentLink1Description: Manufacturer URL; DatasheetVersion: SLVS810B; Mounting Technology: Surface Mount; PartNumber: TPS650061RUKR; PackageVersion: 4208637/C, 01/2012; ComponentLink3URL: http://www.ti.com/litv/pdf/mpqf220b; Step-Down DC/DC Converter: 1; PackageReference: RUK0020B; Supplier 1: Mouser; Supplier Part Number 1: 595-TPS650061RUKR

## Nets that join several sheets
3V3: USB to SATA bridge (18 pins), Power (14 pins)
12V: USB to SATA bridge (F1.2), Power (C14.2 C49.2 J5.1 U3.7)
GND: USB to SATA bridge (28 pins), Power (51 pins)
SATA_5V: USB to SATA bridge (C26.1 J2.P8 J2.P9 R29.1), Power (C17.2 U4.8)
NetR18_1: USB to SATA bridge (U1.4), Power (R18.1 U5.20)
VBUS: USB to SATA bridge (J1.1 R4.2), Power (J4.3)